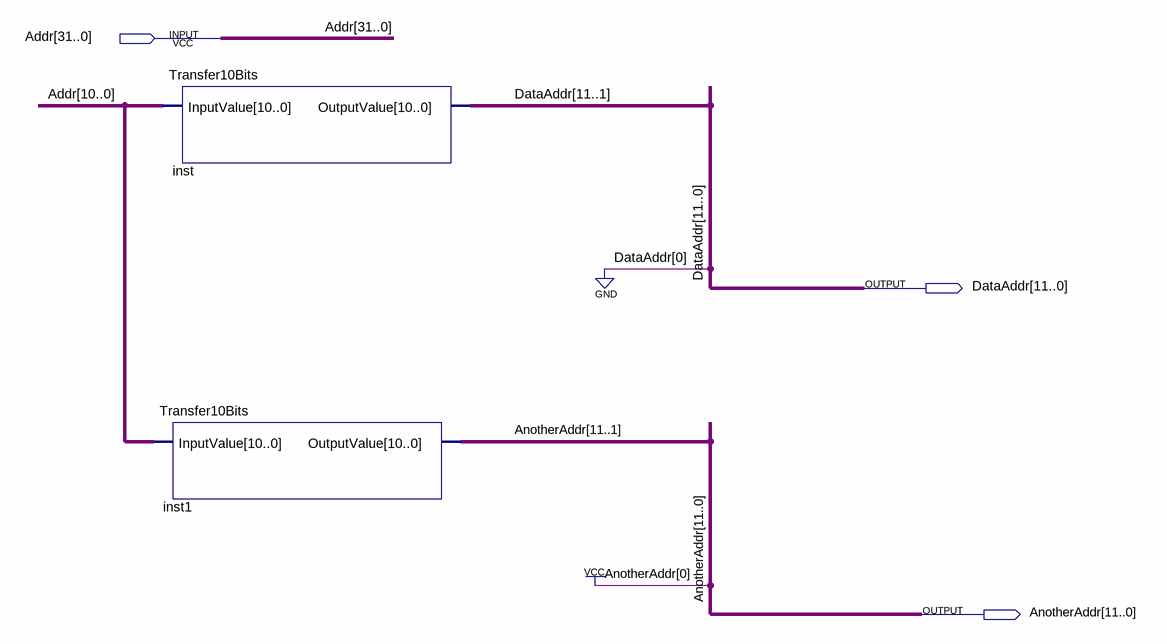
[diagram p0: schematic sheet]
// Quartus schematic GetAddrs.bdf as structural Verilog: 2 symbols, 3 pins
module GetAddrs (
  input  [31:0] Addr,
  output [11:0] DataAddr,
  output [11:0] AnotherAddr
);

  Transfer10Bits inst (.InputValue(Addr[10:0]), .OutputValue(DataAddr[11:1]));
  Transfer10Bits inst1 (.InputValue(Addr[10:0]), .OutputValue(AnotherAddr[11:1]));

  assign AnotherAddr[0] = 1'b1;
  assign DataAddr[0] = 1'b0;
endmodule
